# Altium schematic sheet 00_POWER.SchDoc
size A3; SheetNumber: 1; SheetTotal: 3; SPICEModelCacheBHQUMUQP: <root> / <DocumentId>BHQUMUQP</DocumentId> / </root>
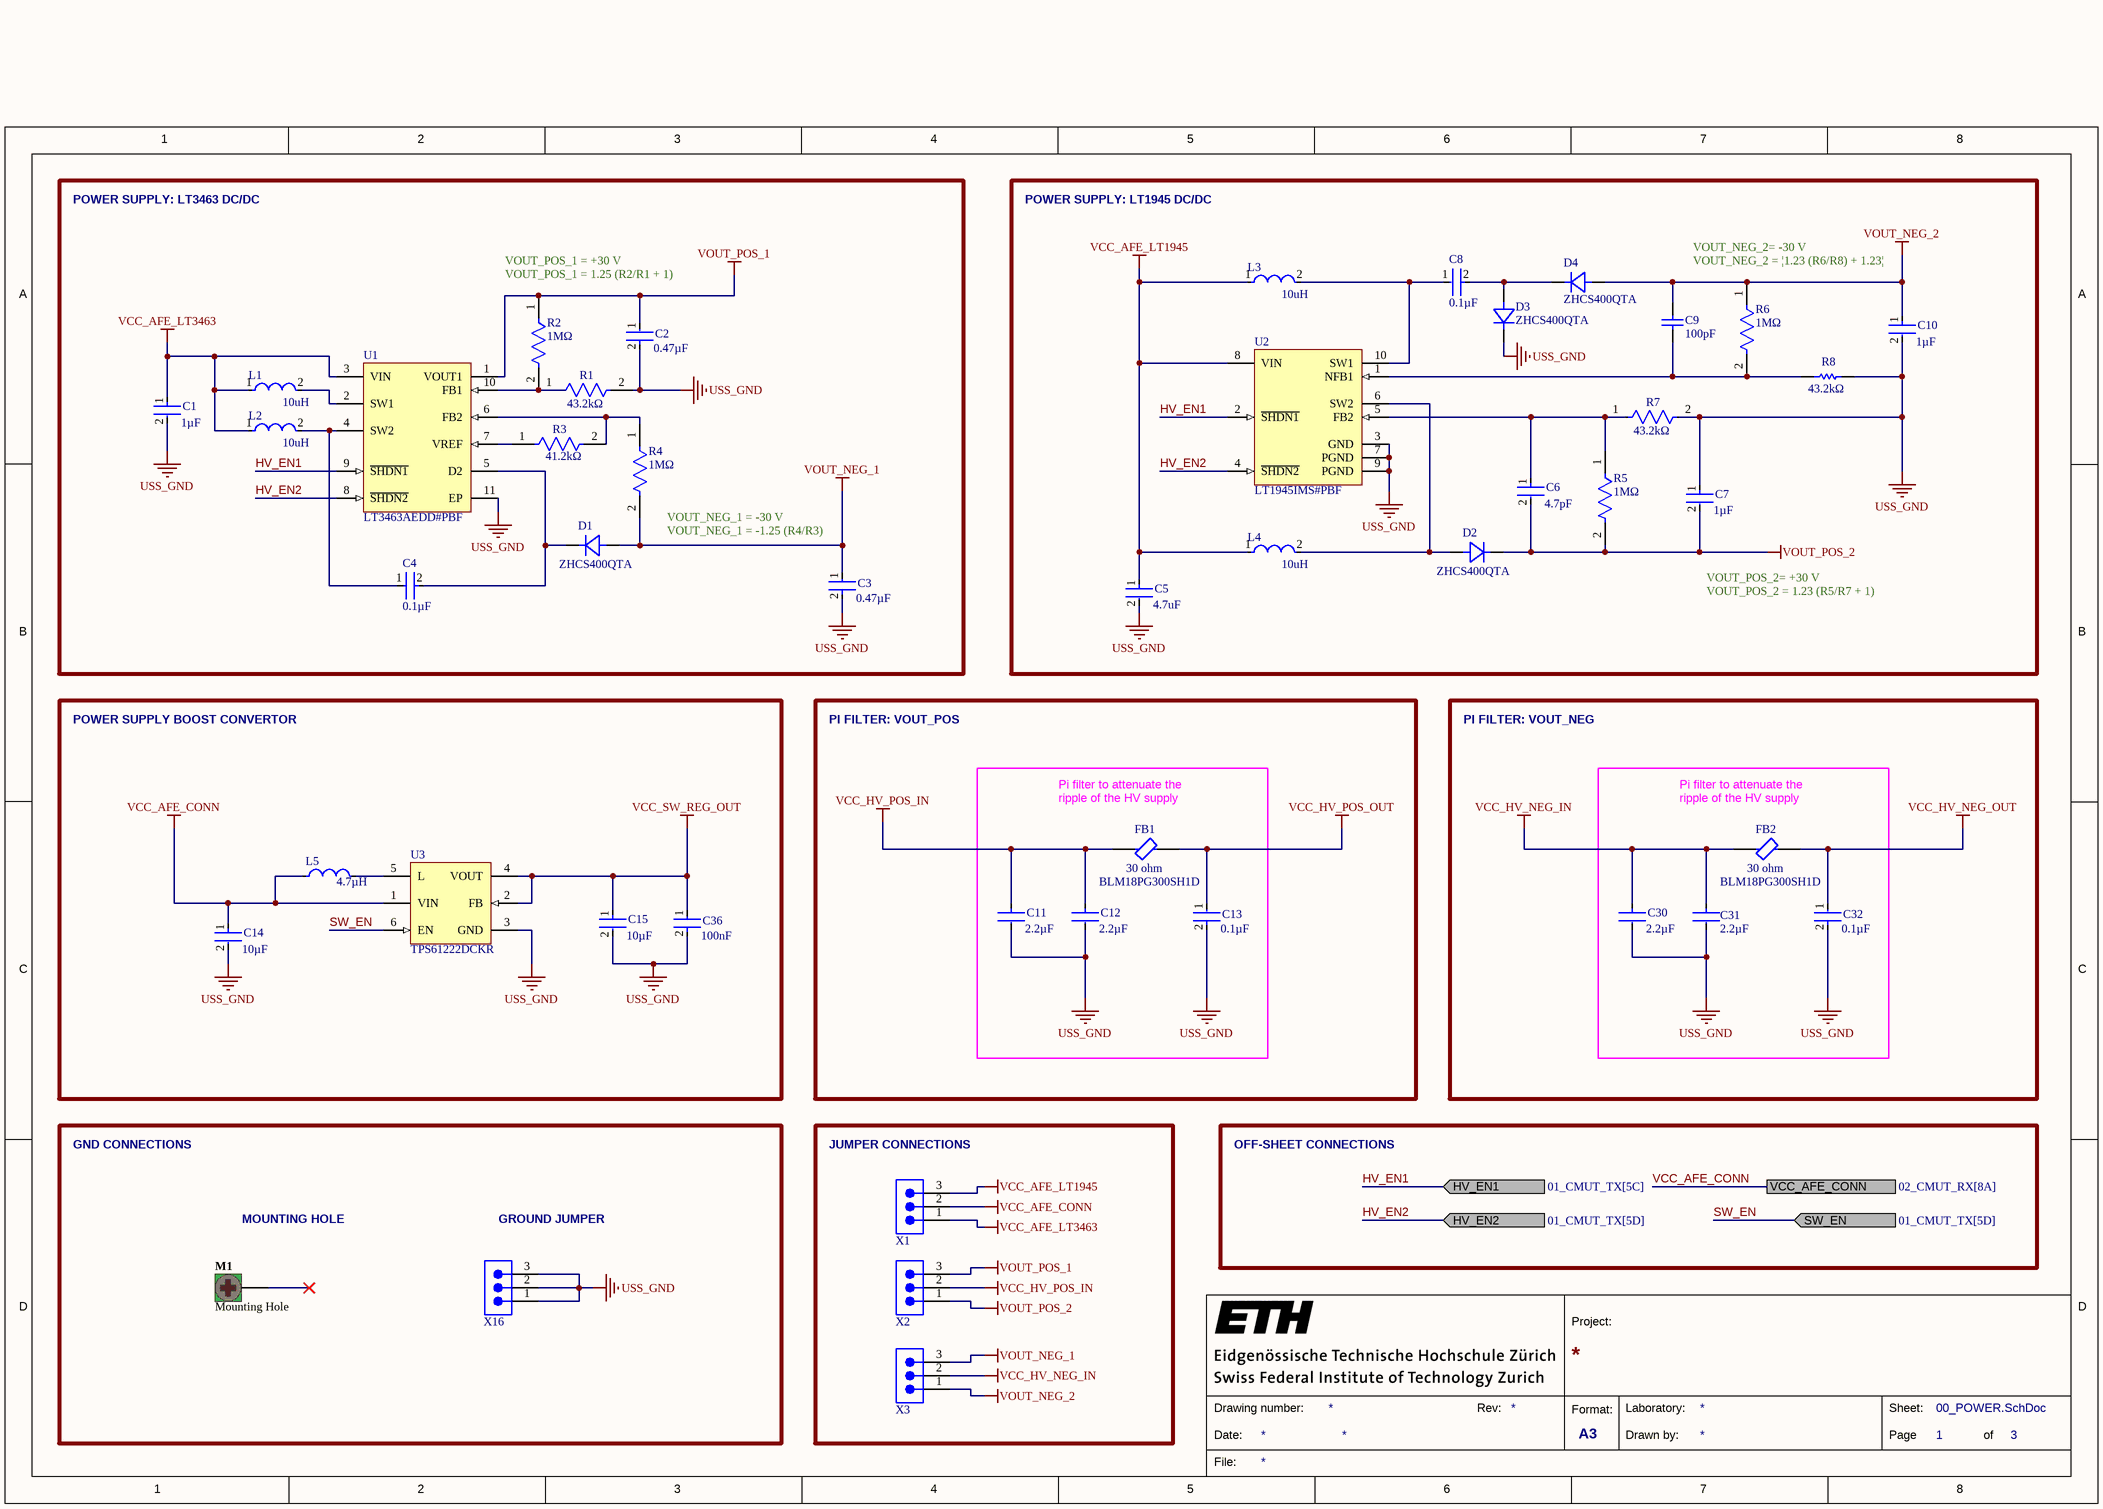
[diagram p0: 00_POWER.SchDoc]

## Parts
C1  Capacitance: 1µF  [FP-CGA3E-0_3-0_1-IPC_B]  (hidden comment: CGA3E3X5R1H105K)
C2  Capacitance: 0.47µF  [FP-C1608-080-0_1-IPC_C]  (hidden comment: C1608X5R1H474K080AB)
C3  Capacitance: 0.47µF  [FP-C1608-080-0_1-IPC_C]  (hidden comment: C1608X5R1H474K080AB)
C4  Capacitance: 0.1µF  [FP-C1608-080-0_1-MFG]  (hidden comment: C1608X5R1H104K080AA)
C5  Capacitance: 4.7uF  [FP-C1608-080-0_2-MFG]  (hidden comment: C1608X5R1V475K080AC)
C6  Capacitance: 4.7pF  [FP-C0603C-CF-MFG]  (hidden comment: C0603C479K5GAC7867)
C7  Capacitance: 1µF  [FP-CGA3E-0_3-0_1-IPC_B]  (hidden comment: CGA3E3X5R1H105K)
C8  Capacitance: 0.1µF  [FP-C1608-080-0_1-MFG]  (hidden comment: C1608X5R1H104K080AA)
C9  Capacitance: 100pF  [CAPC1608X90X35LL15T15]  (hidden comment: 06035C101KAT2A)
C10  Capacitance: 1µF  [FP-CGA3E-0_3-0_1-IPC_B]  (hidden comment: CGA3E3X5R1H105K)
C11  Capacitance: 2.2µF  [FP-GRM188-0_2-IPC_C]  (hidden comment: GRM188R61H225KE11D)
C12  Capacitance: 2.2µF  [FP-GRM188-0_2-IPC_C]  (hidden comment: GRM188R61H225KE11D)
C13  Capacitance: 0.1µF  [FP-C1608-080-0_1-MFG]  (hidden comment: C1608X5R1H104K080AA)
C14  Capacitance: 10µF  [FP-GRM188-0_2-IPC_C]  (hidden comment: GRM188R6YA106MA73D)
C15  Capacitance: 10µF  [FP-GRM188-0_2-IPC_C]  (hidden comment: GRM188R6YA106MA73D)
C30  Capacitance: 2.2µF  [FP-GRM188-0_2-IPC_C]  (hidden comment: GRM188R61H225KE11D)
C31  Capacitance: 2.2µF  [FP-GRM188-0_2-IPC_C]  (hidden comment: Murata GRM188R61H225KE11D)
C32  Capacitance: 0.1µF  [FP-C1608-080-0_1-MFG]  (hidden comment: C1608X5R1H104K080AA)
C36  Capacitance: 100nF  [FP-C1608-080-0_1-MFG]  (hidden comment: C1608X5R1H104K080AA)
D1  ZHCS400QTA  [DIODE_SOD323_DIO]
D2  ZHCS400QTA  [DIODE_SOD323_DIO]
D3  ZHCS400QTA  [DIODE_SOD323_DIO]
D4  ZHCS400QTA  [DIODE_SOD323_DIO]
FB1  BLM18PG300SH1D  Impedance: 30 ohm  [FP-BLM18-0_15-t0_8-IPC_A]
FB2  BLM18PG300SH1D  Impedance: 30 ohm  [FP-BLM18-0_15-t0_8-IPC_A]
L1  Inductance: 10uH  [FP-B82422A-MFG]  (hidden comment: B82422A1103K100)
L2  Inductance: 10uH  [FP-B82422A-MFG]  (hidden comment: B82422A1103K100)
L3  Inductance: 10uH  [FP-B82422A-MFG]  (hidden comment: B82422A1103K100)
L4  Inductance: 10uH  [FP-B82422A-MFG]  (hidden comment: B82422A1103K100)
L5  Inductance: 4.7µH  [FP-NR3012-MFG]  (hidden comment: NR3012T4R7M)
M1  Mounting Hole  [Mounting Hole]  (no BOM)
R1  Resistance: 43.2kΩ  [FP-RC0603-0_55-MFG]  (hidden comment: RC0603FR-0743K2L)
R2  Resistance: 1MΩ  [FP-RC0603-0_55-IPC_C]  (hidden comment: RC0603JR-071ML)
R3  Resistance: 41.2kΩ  [FP-RK73H1J-IPC_A]  (hidden comment: RK73H1JTTDD4122D)
R4  Resistance: 1MΩ  [FP-RC0603-0_55-IPC_C]  (hidden comment: RC0603JR-071ML)
R5  Resistance: 1MΩ  [FP-RC0603-0_55-IPC_C]  (hidden comment: RC0603JR-071ML)
R6  Resistance: 1MΩ  [FP-RC0603-0_55-IPC_C]  (hidden comment: RC0603JR-071ML)
R7  Resistance: 43.2kΩ  [FP-RC0603-0_55-MFG]  (hidden comment: RC0603FR-0743K2L)
R8  Resistance: 43.2kΩ  [RESC1608X55X30ML20T10]  (hidden comment: RK73H1JTTD4322F)
U1  LT3463AEDD#PBF  [LT-DD-10_V]
U2  LT1945IMS#PBF  [LT-MS-10_L]
U3  TPS61222DCKR  [DCK0006A_L]
X1  68000-103HLF  [68000-103HLF]  (value not drawn)
X2  68000-103HLF  [68000-103HLF]  (value not drawn)
X3  68000-103HLF  [68000-103HLF]  (value not drawn)
X16  68000-103HLF  [68000-103HLF]  (value not drawn)

## Blocks framed on the sheet
POWER SUPPLY BOOST CONVERTOR: C14 C15 C36 L5 U3
PI FILTER: VOUT_POS: C11-C13 FB1
PI FILTER: VOUT_NEG: C30-C32 FB2
JUMPER CONNECTIONS: X1-X3

## Ports
HV_EN1 (in, see 01_CMUT_TX[5C]), HV_EN2 (in, see 01_CMUT_TX[5D]), SW_EN (in, see 01_CMUT_TX[5D]), VCC_AFE_CONN (see 02_CMUT_RX[8A])

## Nets
USS_GND: C1.2 C2.2 C3.2 C5.2 C7.1 C10.2 C11.2 C12.2 C13.2 C14.2 C15.2 C30.2 C31.2 C32.2 C36.2 D3.1 R1.2 R7.2 R8.2 U1.11(EP) U2.3(GND) U2.7(PGND) U2.9(PGND) U3.3(GND) X16.1 X16.2 X16.3
VCC_AFE_CONN: C14.1 L5.1 U3.1(VIN) X1.2 ; port VCC_AFE_CONN
VCC_AFE_LT1945: C5.1 L3.1 L4.1 U2.8(VIN) X1.3
VCC_AFE_LT3463: C1.1 L1.1 L2.1 U1.3(VIN) X1.1
VCC_HV_NEG_IN: C30.1 C31.1 FB2.1 X3.2
VCC_HV_NEG_OUT: C32.1 FB2.2
VCC_HV_POS_IN: C11.1 C12.1 FB1.1 X2.2
VCC_HV_POS_OUT: C13.1 FB1.2
VCC_SW_REG_OUT: C15.1 C36.1 U3.2(FB) U3.4(VOUT)
VOUT_NEG_1: C3.1 D1.2 R4.2 X3.3
VOUT_NEG_2: C9.2 C10.1 D4.2 R6.1 X3.1
VOUT_POS_1: C2.1 R2.1 U1.1(VOUT1) X2.3
VOUT_POS_2: C6.2 C7.2 D2.1 R5.2 X2.1
HV_EN1: U1.9(~{SHDN1}) U2.2(~{SHDN1}) ; port HV_EN1
HV_EN2: U1.8(~{SHDN2}) U2.4(~{SHDN2}) ; port HV_EN2
SW_EN: U3.6(EN) ; port SW_EN
NetC4_1: C4.1 L2.2 U1.4(SW2)
NetC4_2: C4.2 D1.1 U1.5(D2)
NetC6_1: C6.1 R5.1 R7.1 U2.5(FB2)
NetC8_1: C8.1 L3.2 U2.10(SW1)
NetC8_2: C8.2 D3.2 D4.1
NetC9_1: C9.1 R6.2 R8.1 U2.1(NFB1)
NetD2_2: D2.2 L4.2 U2.6(SW2)
NetL1_2: L1.2 U1.2(SW1)
NetL5_2: L5.2 U3.5(L)
NetR1_1: R1.1 R2.2 U1.10(FB1)
NetR3_1: R3.1 U1.7(VREF)
NetR3_2: R3.2 R4.1 U1.6(FB2)

Not connected (* = marked no-connect by the designer): M1 1*

## Notes on the sheet
- POWER SUPPLY: LT3463 DC/DC
- POWER SUPPLY: LT1945 DC/DC
- VOUT_POS_1 = 1.25 (R2/R1 + 1)
- VOUT_POS_1 = +30 V
- VOUT_NEG_2 = |1.23 (R6/R8) + 1.23|
- VOUT_NEG_2= -30 V
- VOUT_NEG_1 = -1.25 (R4/R3)
- (near R4) VOUT_NEG_1 = -30 V
- VOUT_POS_2= +30 V
- VOUT_POS_2 = 1.23 (R5/R7 + 1)
- (near FB1) Pi filter to attenuate the ripple of the HV supply
- (near FB2) Pi filter to attenuate the ripple of the HV supply
- GND CONNECTIONS
- OFF-SHEET CONNECTIONS
- MOUNTING HOLE
- (near X16) GROUND JUMPER
- 1
- 2
- 3
- 4
- 5
- 6
- 7
- 8
- A
- B
- C
- D
- Project:
- Date:
- Drawing number:
- Rev:
- Format:
- A3
- Drawn by:
- Laboratory:
- Page
- Sheet:
- of
- File:

## Library data of the parts
C1 C7 C10 = CMP-08246-000317-1: Cap Ceramic 1uF 50V X5R 10% Pad SMD 0603 +85°C Automotive T/R; Termination: SMD/SMT; Tolerance: 10%; Case Code (Metric): 1608; Max Operating Temperature: 85°C; Case/Package: 0603; Voltage Rating: 50V; Dielectric: X5R; Case Code (Imperial): 0603; Packaging: Tape and Reel; Min Operating Temperature: -55°C; Voltage Rating (DC): 50V
C2 C3 = CMP-08246-003456-1: Multilayer Ceramic Capacitors 470nF ±10% 50V X5R SMD 0603; Termination: SMD/SMT; Weight: 7.1E-05oz; Depth: 0.8mm; Mount: Surface Mount; Voltage Rating (DC): 50V; RoHS Compliant: Yes; Dielectric: X5R; Voltage: 50V; Package Quantity: 1; Series: C; Max Operating Temperature: 85°C; Construction: Flat; Tolerance: 10%; Voltage Rating: 50V; Packaging: Tape and Reel; Number of Pins: 2; Case Code (Imperial): 0603; Resistor Type: Ceramic; Min Operating Temperature: -55°C; Height: 0.8mm; Case/Package: 0603; Dielectric Material: Ceramic; Radiation Hardening: No; Case Code (Metric): 1608; REACH SVHC: No SVHC; Thickness: 0.035inch; Width: 0.031inch; Length: 1.6mm; Lead Free: Lead Free
C4 C8 C13 C32 C36 = CMP-08246-002719-1: Multilayer Ceramic Capacitors 100nF ±10% 50V X5R SMD 0603; Radiation Hardening: No; Length: 1.6mm; Package Quantity: 1; Thickness: 0.035inch; Max Operating Temperature: 85°C; Series: C; RoHS Compliant: Yes; Weight: 7.1E-05oz; Resistor Type: Ceramic; Case/Package: 0603; Voltage Rating: 50V; Tolerance: 10%; Width: 0.031inch; Voltage Rating (DC): 50V; Termination: SMD/SMT; Case Code (Metric): 1608; Construction: Flat; Mount: Surface Mount; Dielectric Material: Ceramic; Number of Pins: 2; Lead Free: Lead Free; Packaging: Tape and Reel; Min Operating Temperature: -55°C; Dielectric: X5R; Case Code (Imperial): 0603; Depth: 0.8mm; Height: 0.8mm; REACH SVHC: No SVHC
C5 = CMP-08246-004349-1: CAP CER 4.7UF 35V X5R 0603; Tolerance: 10%; Dielectric Material: Ceramic; Length: 0.063inch; Case/Package: 0603; Case Code (Metric): 1608; Packaging: Tape and Reel; Width: 0.031inch; Voltage Rating: 35V; Mount: Surface Mount; Package Quantity: 1; Depth: 0.8mm; Case Code (Imperial): 0603; Lead Free: Lead Free; Voltage Rating (DC): 35V; RoHS Compliant: Yes; Resistor Type: Ceramic; Series: C; Dielectric: X5R; Thickness: 0.039inch; Min Operating Temperature: -55°C; REACH SVHC: No SVHC; Max Operating Temperature: 85°C; Termination: SMD/SMT; Weight: 7.1E-05oz; Height: 0.8mm
C6 = CMP-03020-034431-1: CAP CER 4.7PF 50V NP0 0603; Manufacturer: KEMET; Automotive Grade: Grade 1; Material: Ceramic; Temperature Coefficient: 30ppm/°C; Temperature Characteristic: C0G; Tolerance: 0.1; Device Class L2: Capacitors; Temperature Range High: +125°C; Octopart: https://octopart.com/c0603c479k5gac7867-kemet-2009260; Temperature: -55°C to +125°C; Manufacturer Part Number: C0603C479K5GAC7867; Device Class L1: Passive Components; Temperature Range Low: -55°C; ComponentLink2Description: Datasheet; Automotive: Yes; Voltage Rating: 50 V; Height: 0.87mm; RoHS: TRUE; Digikey Description: CAP CER 4.7PF 50V NP0 0603; ComponentLink2URL: https://api.kemet.com/component-edge/download/datasheet/C0603C100J5GACAUTO.pdf; Lead Free: Yes; Package: C0603C-CF; Device Class L3: Ceramic Capacitors; Category: Cap; Value: 4.7 pF
C9 = CMP-2006-04375-1: Manufacturer: AVX Interconnect / Elco; Part Number: 06035C101KAT2A
C11 C12 C30 C31 = CMP-06035-042125-1: Chip Multilayer Ceramic Capacitors for General Purpose, 0603, 2.2uF, X5R, 15%, 10%, 50V; Case Code (Metric): 1608; Packaging: Cut Tape; REACH SVHC: No SVHC; Material: Ceramic; Voltage Rating: 50V; Min Operating Temperature: -55°C; Length: 0.063inch; Case Code (Imperial): 0603; Tolerance: 10%; Thickness: 0.039inch; Height: 0.8mm; Case/Package: 0603; Voltage Rating (DC): 50V; Dielectric: X5R; Mount: Surface Mount; Max Operating Temperature: 85°C; Width: 0.031inch
C14 C15 = CMP-06035-045466-1: Chip Multilayer Ceramic Capacitors for General Purpose, 0603, 10uF, X5R, 15%, 20%, 35V; Case Code (Imperial): 0603; Voltage Rating (DC): 35V; Width: 0.031inch; Dielectric: X5R; Voltage Rating: 35V; Min Operating Temperature: -55°C; Thickness: 0.039inch; Mount: Surface Mount; Case/Package: 0603; Length: 0.063inch; Max Operating Temperature: 85°C; Packaging: Tape and Reel; Tolerance: 20%; Case Code (Metric): 1608
D1-D4 = ZHCS400QTA: Diode Schottky 40V 1A Automotive 2-Pin SOD-323 T/R; Manufacturer: Diodes; Supplier 1: Farnell; RoHS: Yes; Category: Rectifier Diodes; Stock 1: 385; Pricing 1: 5=0.87300, 10=0.73400, 100=0.49400, 500=0.38800 (CHF); Mount: Surface Mount; Packaging: Tape and Reel; Average Rectified Current: 1A; Max Reverse Voltage (DC): 40V; RoHS Compliant: Yes; ComponentLink1URL: http://www.mouser.com/ds/2/115/ZHCS400Q-959646.pdf?src-supplier=Mouser; ComponentLink1Description: http://www.mouser.com/ds/2/115/ZHCS400Q-959646.pdf?src-supplier=Mouser; Supplier Part Number 1: 3127490; Manufacturer Part Number: ZHCS400QTA
FB1 FB2 = CMP-06046-000808-1: Chip Ferrite Bead, 0603, 30Ω @ 100MHz, 0.05Ω, , 1A; Tolerance: 25%; Shielding: Unshielded; DC Resistance (DCR): 50mR; Number of Lines: 1; Width: 0.031inch; Termination: SMD/SMT; Case Code (Metric): 1608; Max DC Current: 1A; Case Code (Imperial): 0603; Height: 0.037inch; Max Operating Temperature: 125°C; Max Current Rating: 1A; Case/Package: 0603; Length: 1.6mm; Number of Circuits: 1; Test Frequency: 100MHz; Contact Plating: Tin; Ratings: AEC-Q200; Package Quantity: 1; Mount: Surface Mount; Packaging: Tape and Reel; Min Operating Temperature: -55°C
L1-L4 = CMP-2000-05912-2: FIXED IND 10UH 180MA 1.6 OHM SMD; Tolerance: 10%; DC Resistance (DCR): 1.6R; Shielding: Unshielded; Core Material: Ferrite; Q Factor: 27; Self Resonant Frequency: 25MHz; Test Frequency: 1MHz; Series: SIMID; Current Rating: 180mA; Ratings: AEC-Q200; Height - Seated (Max): 0.083inch; Packaging: Tape and Reel; Radiation Hardening: No; REACH SVHC: No SVHC; Width: 0.098inch; RoHS Compliant: Yes; Case/Package: 1210; DC Current: 180mA; Package Quantity: 2000; Rated Current-Max: 180mA; Mount: Surface Mount; Depth: 2.8mm; Resistor Type: Wirewound; Max DC Current: 180mA; Termination: SMD/SMT; Contact Plating: Tin; Height: 2.1mm; Case Code (Metric): 3225; Lead Free: Lead Free; Weight: 0.001764oz; Max Operating Temperature: 125°C; Length: 3.5mm; Case Code (Imperial): 1210; Inductance Tolerance: 10%; Series Resistance: 1.6R; Number of Pins: 2; Military Standard: Not
L5 = CMP-14484-001484-1: SMD Power Inductors 4.7uH ±20% 0.77A 0.13Ω; Saturation Current: 770mA; Self Resonant Frequency: 48MHz; RMS Current (Irms): 980mA; Test Frequency: 100kHz; Core Material: Ferrite; Shielding: Shielded; DC Resistance (DCR): 156mR; Series: NR; Case Code (Metric): 3030; Halogen Free: Halogen Free; Tolerance: 20%; Resistor Type: Wirewound; Mount: Surface Mount; Case/Package: 1212; Max DC Current: 770mA; Length: 0.118inch; Height - Seated (Max): 0.047inch; Termination: SMD/SMT; Package Quantity: 2000; DC Current: 980mA; Depth: 3.1mm; Packaging: Tape and Reel; Height: 1.2mm; Current Rating: 980mA; Min Operating Temperature: -25°C; Case Code (Imperial): 1212; Lead Free: Lead Free; Military Standard: Not; Width: 0.118inch; Max Operating Temperature: 120°C; Radiation Hardening: No; Inductance Tolerance: 20%; RoHS Compliant: Yes
M1 = CMP-00274-1: M2 Hole, 2.4mm drill, 5mm landing pads, 3mm pad in middle layers, no overlay; ClassName: Mounting Hole
R1 R7 = CMP-03412-037801-1: RES SMD 43.2K OHM 1% 1/10W 0603; Power Rating: 100mW; Voltage Rating (DC): 50V; Temperature Coefficient: 100ppm/°C; Depth: 0.8mm; Resistor Type: Thick Film; Mount: Surface Mount; Height: 0.45mm; Termination: SMD/SMT; Case Code (Imperial): 0603; Case Code (Metric): 1608; Case/Package: 0603; Length: 1.6mm; Min Operating Temperature: -55°C; Max Power Dissipation: 100mW; Construction: Rectangular; Lead Free: Lead Free; Features: Moisture Resistant; Technology: THICK FILM; RoHS Compliant: Yes; Packaging: Tape and Reel; Package Quantity: 1; Width: 0.031inch; Tolerance: 1%; Number of Terminations: 2; Series: RC; Voltage Rating: 50V; Max Operating Temperature: 155°C; Size Code: 0603; Military Standard: Not
R2 R4-R6 = CMP-2000-06953-2: RES SMD 1M OHM 5% 1/10W 0603; Voltage Rating (DC): 50V; Power Rating: 100mW; Temperature Coefficient: 100ppm/°C; Features: Moisture Resistant; Package Quantity: 5000; Case Code (Imperial): 0603; Packaging: Tape and Reel; Resistor Type: Thick Film; Number of Pins: 2; Size Code: 0603; Resistance Tolerance: 5%; Max Operating Temperature: 155°C; Voltage Rating: 50V; Depth: 0.8mm; Termination: SMD/SMT; Width: 0.8mm; RoHS Compliant: Yes; Number of Terminations: 2; Height: 0.45mm; Lead Free: Lead Free; Case/Package: 0603; Military Standard: Not; Min Operating Temperature: -55°C; Case Code (Metric): 1608; Radiation Hardening: No; Series: RC; Length: 1.6mm; Tolerance: 5%; REACH SVHC: No SVHC; Contact Plating: Tin; Construction: Rectangular; Max Power Dissipation: 100mW
R3 = CMP-04015-070888-1: 41.2kΩ ±0.5% 0.1W Chip Resistor 0603 Thick Film AEC-Q200 Qualified; Power Rating: 100mW; Voltage Rating: 50V; Temperature Coefficient: 100ppm/°C; Packaging: Tape and Reel; RoHS Compliant: Yes; Case Code (Imperial): 0603; Termination: SMD/SMT; Case Code (Metric): 1608; Max Operating Temperature: 155°C; Length: 1.6mm; Height: 0.45mm; Min Operating Temperature: -55°C; Case/Package: 0603; Width: 0.8mm; Resistor Type: Thick Film; Series: RK73H; Tolerance: 0.5%; Weight: 7.1E-05oz
R8 = CMP-2000-01507-1: Manufacturer: KOA Speer; Part Number: RK73H1JTTD4322F
U1 = CMP-0478-00030-1: Dual Micropower DC/DC Converters with Schottky Diodes, 2.4 to 15 V Vin, 10-pin SON (DD-10), -40 to 85 degC, Pb-Free; Manufacturer: Linear Technology; Vin Max(V): 15; Number of Outputs: 2; Vin Min(V): 2.4; ComponentLink3URL: http://cds.linear.com/docs/en/packaging/DFN_10_05-08-1699.pdf; ComponentLink2URL: http://cds.linear.com/docs/en/datasheet/3463f.pdf; PackageReference: DD-10; PackageVersion: Rev. C, 06/2010; ComponentLink1URL: http://www.linear.com/; RoHS: TRUE; ComponentLink3Description: Package Specification; Mounting Technology: Surface Mount; PartNumber: LT3463AEDD#PBF; Code_JEDEC: MO-229; ComponentLink2Description: Datasheet; PackageDescription: 10-Pin Plastic DFN, Body 3 x 3 mm, Pitch 0.5 mm; ComponentLink1Description: Manufacturer URL
U2 = CMP-0478-00154-1: Dual Micropower DC/DC Converter with Positive and Negative Outputs, 1.2 to 15 V Vin, 10-pin SOP (MS-10), -40 to 125 degC, Pb-Free; Manufacturer: Linear Technology; Vin Min(V): 1.2; Vin Max(V): 15; Number of Outputs: 2; Mounting Technology: Surface Mount; ComponentLink3Description: Package Specification; ComponentLink3URL: http://cds.linear.com/docs/en/packaging/05081661_F_MS.pdf; PackageVersion: Rev. E, 06/2010; ComponentLink2URL: http://cds.linear.com/docs/en/datasheet/1945fa.pdf; PartNumber: LT1945IMS#PBF; DatasheetVersion: Rev. A; PackageReference: MS-10; PackageDescription: 10-Pin Plastic MSOP, Body 3 x 3 mm, Pitch 0.5 mm; ComponentLink2Description: Datasheet; RoHS: TRUE; ComponentLink1URL: http://www.linear.com/; ComponentLink1Description: Manufacturer URL
U3 = CMP-0347-00055-2: Boost Voltage Converter with 0.7 to 5.5 V Input and 5 V Output, -40 to 85 degC, 6-Pin SC70 (DCK), Green (RoHS & no Sb/Br); Manufacturer: Texas Instruments; Vout(Min)(V): 5; SubFamily: Step-Up Regulator; Vin(Min)(V): 0.7; Switching Frequency(Max)(kHz): 2000; Regulated Outputs(#): 1; Vin(Max)(V): 5.5; Topology: Boost; Vout(Max)(V): 5; PackageVersion: revG, Jan-2007; Mounting Technology: Surface Mount; ComponentLink2URL: http://www.ti.com/litv/pdf/mpds114c; PackageReference: DCK0006A; DatasheetVersion: SLVS776; PartNumber: TPS61222DCKR; ComponentLink1Description: Datasheet; ComponentLink1URL: http://www.ti.com/general/docs/lit/getliterature.tsp?genericPartNumber=TPS61222&fileType=pdf; ComponentLink2Description: Package Specification; Eco-Plan: Green (RoHS & no Sb/Br); Code_JEDEC: MO-203-AB; PackageDescription: 6-Pin Plastic Small-Outline Package, 2 x 1.3 mm Body, 0.65 mm Pitch, 2.1 mm Lead Span
X1-X3 X16 = CMP-00101-2: 3 Positions Header, Unshrouded Connector 0.100" (2.54mm) Through Hole Gold or Gold, GXT™; Manufacturer: Amphenol FCI; Current Rating: 3A; Insulation Resistance: 5GR; Number of Positions: 3; Max Voltage Rating (AC): 1.5kV; Termination: Solder; Fastening Type: -; Features: -; Contact Finish: Gold or Gold, GXT™; Contact Finish Thickness: 15µin (0.38µm); Color: Black; Supplier: Digikey; Supplier Part Number: 609-3461-ND; ComponentLink1Description: 68000-274283-5157301.pdf; ComponentLink1URL: https://datasheet.ciiva.com/5157/68000-274283-5157301.pdf; Depth: 2.41mm; Flammability Rating: UL94 V-0; Housing Colour: Black; Housing Material: Thermoplastic; Length: 7.62mm; Manufacturer Part Number: 68000-103HLF; Max Operating Temperature: 125°C; Packaging: Bulk; Contact Type: Male Pin; Connector Type: Header, Unshrouded; Pitch: 2.54mm; Number of Rows: 1; Contact Mating Length: 0.230" (5.84mm); Mounting Type: Through Hole; Min Operating Temperature: -65°C; Number of Contacts: 3; Orientation: Straight; Package Quantity: 100; Radiation Hardening: No; REACH SVHC: No SVHC; Termination Post Length: 2.41mm; Voltage Rating: 1.5kV; Contact Gender: Male; Contact Material: Bronze; Contact Plating: Nickel,Gold,GXT; ComponentLink2Description: 68000-731071.pdf; ComponentLink2URL: https://datasheet.ciiva.com/731/68000-731071.pdf; ComponentLink3Description: 68000-10149754.pdf; ComponentLink3URL: https://datasheet.ciiva.com/10149/68000-10149754.pdf; ComponentLink4Description: 1914865-46392021.pdf; ComponentLink4URL: https://datasheet.ciiva.com/46392/1914865-46392021.pdf